# Altium project smu_unit.PrjPcb
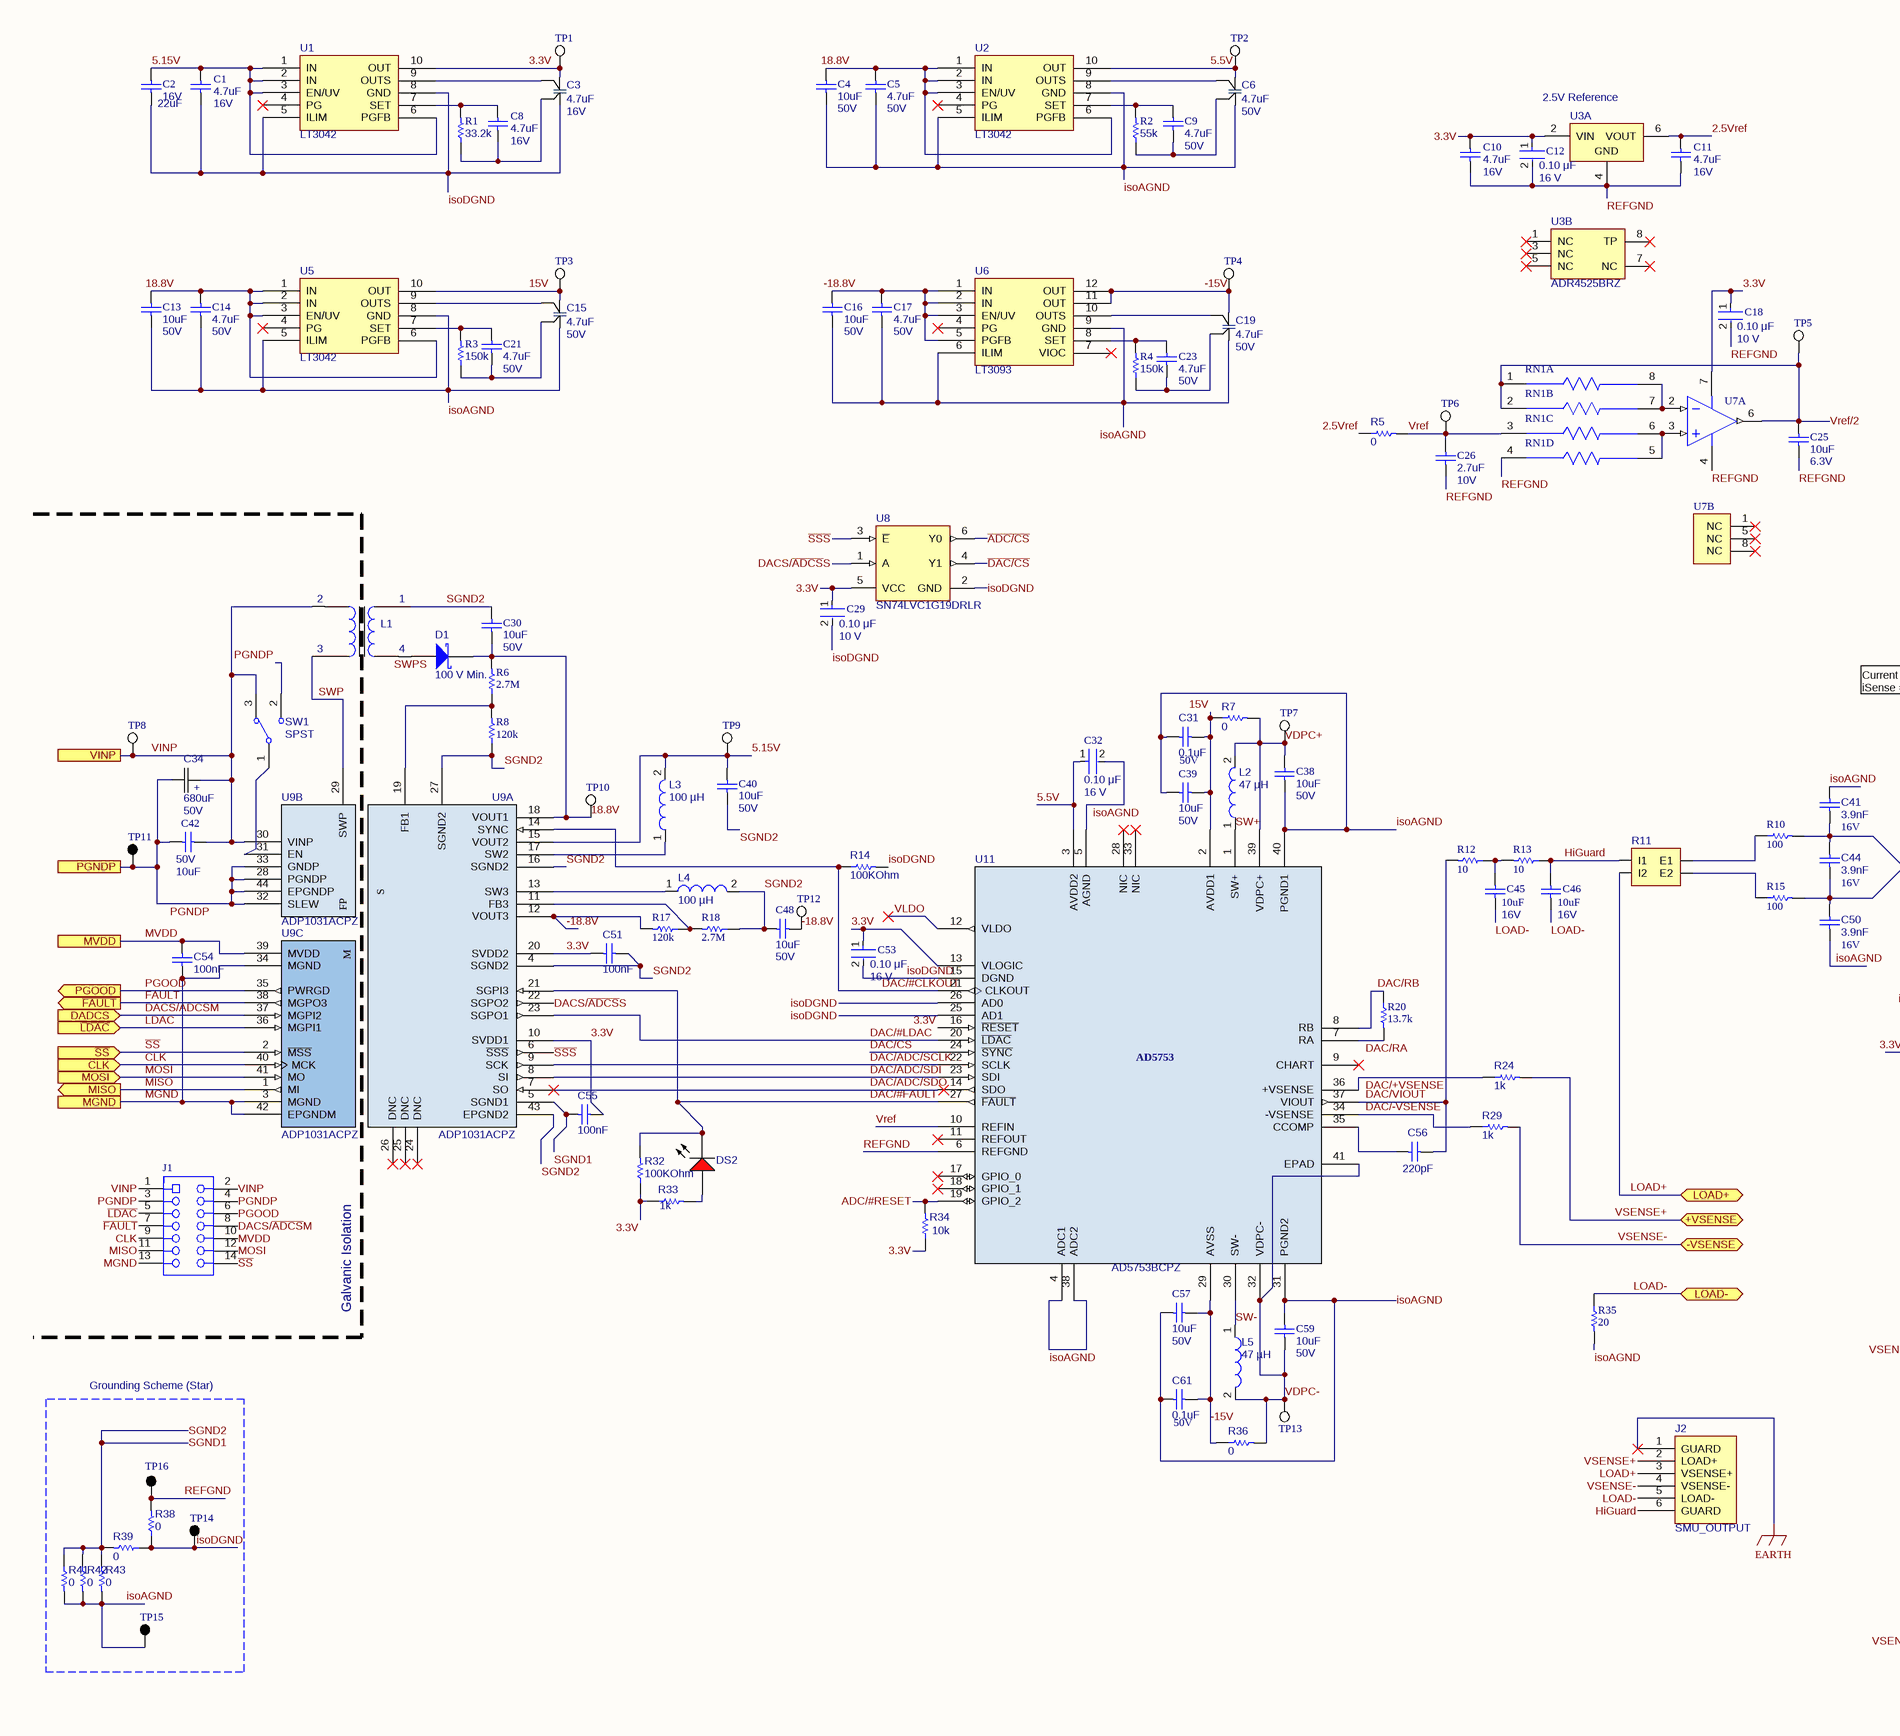
[diagram p0: smu_unit.SchDoc, left]
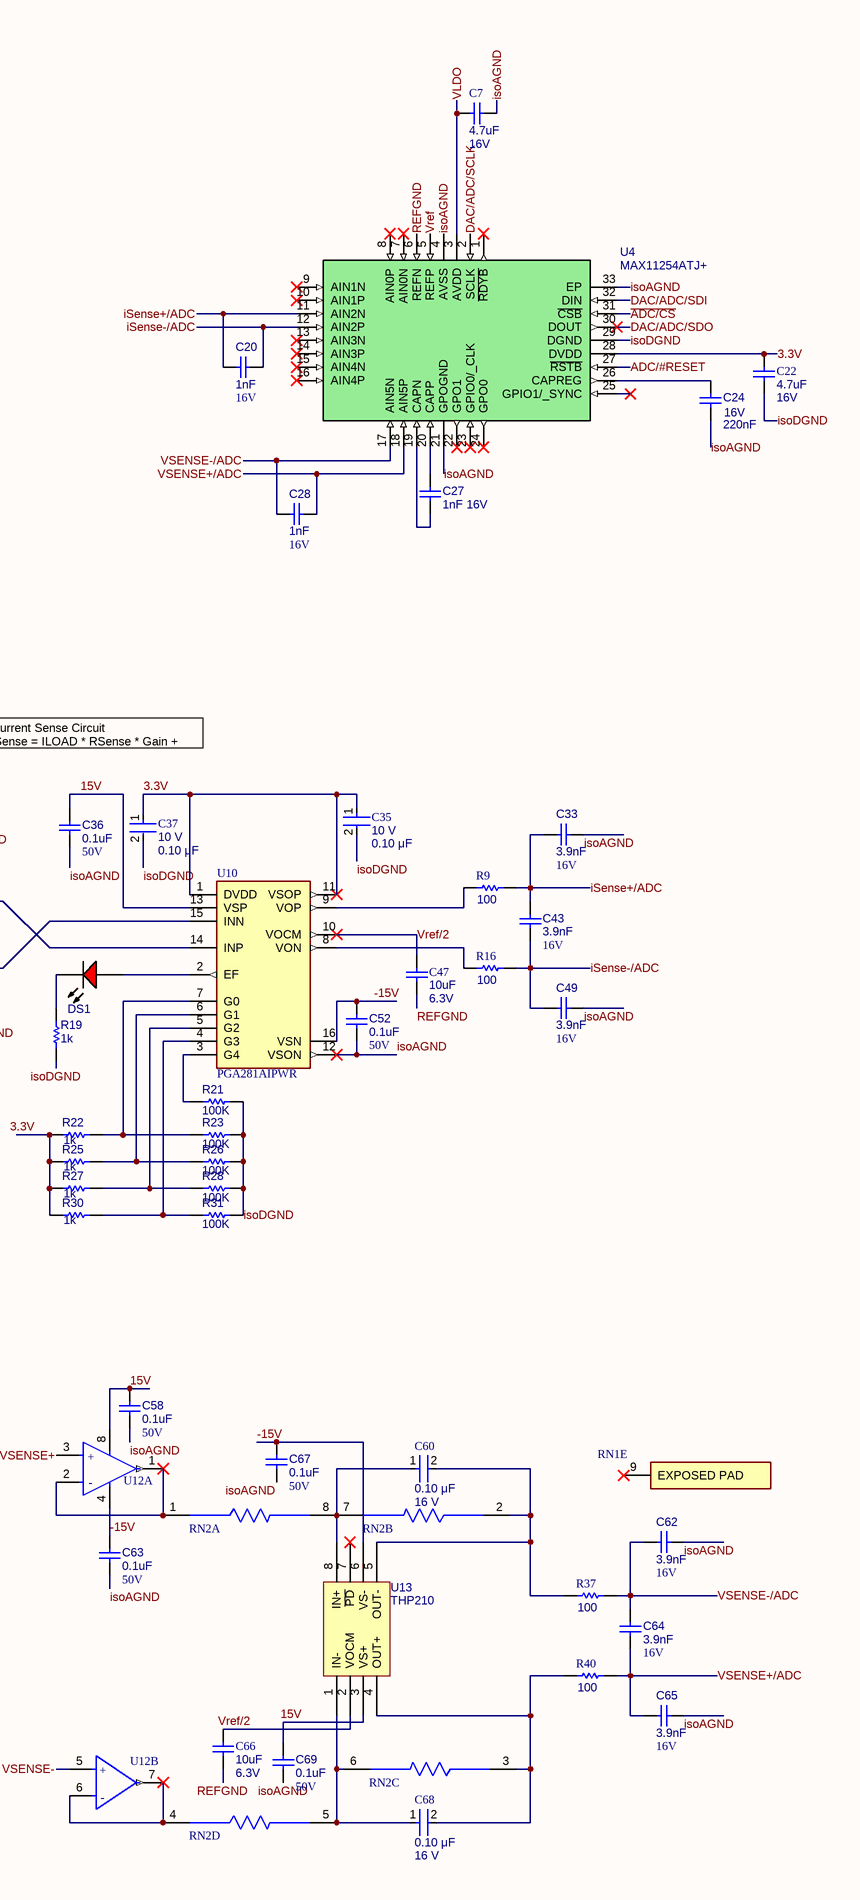
[diagram p1: smu_unit.SchDoc, right]
1 sheet, 154 parts. Net scope: flat (ports and power ports of the same name join across sheets).
Board file: smu_unit.PcbDoc

## Sheet smu_unit.SchDoc: IMEBUILD V3 SMU_UNIT
size A2; Organization: Lightwave Lab; Address1: Princeton University; Address2: Princeton NJ 08544; Address3: United States; DocumentNumber: 1; Revision: C; SheetNumber: 1; SheetTotal: 3

### Parts
C1  value 4.7uF  Rated Voltage: 16V  [CAPC2013X140X50ML20T25]  (hidden comment: C0805C475J4RACAUTO)
C2  Rated Voltage: 16V  Capacitance: 22uF  [CAPC3225X270X30ML30]  (hidden comment: ‎GRM32ER71C226KEA8L‎)
C3  value 4.7uF  Rated Voltage: 16V  [CAP0805_4P]  (hidden comment: CAP08054P)
C4  Capacitance: 10uF  Voltage Rating (DC): 50V  [CAPC3225X280X50ML20T25]  (hidden comment: C1210C106K5RACTU)
C5  Capacitance: 4.7uF  Voltage Rating (DC): 50V  [CAPC3225X280X50ML20T25]  (hidden comment: C1206X475J5RAC7800)
C6  value 4.7uF  Rated Voltage: 50V  [CAP0805_4P]  (hidden comment: CAP08054P)
C7  value 4.7uF  Rated Voltage: 16V  [CAPC2013X140X50ML20T25]  (hidden comment: C0805C475J4RACAUTO)
C8  value 4.7uF  Rated Voltage: 16V  [CAPC2013X140X50ML20T25]  (hidden comment: C0805C475J4RACAUTO)
C9  Capacitance: 4.7uF  Voltage Rating (DC): 50V  [CAPC3225X280X50ML20T25]  (hidden comment: C1206X475J5RAC7800)
C10  value 4.7uF  Rated Voltage: 16V  [CAPC2013X140X50ML20T25]  (hidden comment: C0805C475J4RACAUTO)
C11  value 4.7uF  Rated Voltage: 16V  [CAPC2013X140X50ML20T25]  (hidden comment: C0805C475J4RACAUTO)
C12  Capacitance: 0.10 μF  Voltage Rating: 16 V  [FP-C0805C-DN-IPC_A]  (hidden comment: C0805C104J4RACTU)
C13  Capacitance: 10uF  Voltage Rating (DC): 50V  [CAPC3225X280X50ML20T25]  (hidden comment: C1210C106K5RACTU)
C14  Capacitance: 4.7uF  Voltage Rating (DC): 50V  [CAPC3225X280X50ML20T25]  (hidden comment: C1206X475J5RAC7800)
C15  value 4.7uF  Rated Voltage: 50V  [CAP0805_4P]  (hidden comment: CAP08054P)
C16  Capacitance: 10uF  Voltage Rating (DC): 50V  [CAPC3225X280X50ML20T25]  (hidden comment: C1210C106K5RACTU)
C17  Capacitance: 4.7uF  Voltage Rating (DC): 50V  [CAPC3225X280X50ML20T25]  (hidden comment: C1206X475J5RAC7800)
C18  Voltage Rating: 10 V  Capacitance: 0.10 μF  [FP-C0805C-DN-IPC_A]  (hidden comment: C0805C104J8RACTU)
C19  value 4.7uF  Rated Voltage: 50V  [CAP0805_4P]  (hidden comment: CAP08054P)
C20  Capacitance: 1nF  Voltage Rating: 16V  [CAPC1608X90X20ML10]  (hidden comment: CGA3E2X7R1H104K080AA)
C21  Capacitance: 4.7uF  Voltage Rating (DC): 50V  [CAPC3225X280X50ML20T25]  (hidden comment: C1206X475J5RAC7800)
C22  value 4.7uF  Rated Voltage: 16V  [CAPC2013X140X50ML20T25]  (hidden comment: C0805C475J4RACAUTO)
C23  Capacitance: 4.7uF  Voltage Rating (DC): 50V  [CAPC3225X280X50ML20T25]  (hidden comment: C1206X475J5RAC7800)
C24  Voltage: 16V  Capacitance: 220nF  [CAPC1608X90X40ML10T20]  (hidden comment: CC0603KRX7R7BB224)
C25  value 10uF  Rated Voltage: 6.3V  [CAPC2013X140X50ML20T25]  (hidden comment: C0805X106J9RAC7800)
C26  value 2.7uF  Rated Voltage: 10V  [CAPC2013X145X50ML20T25]  (hidden comment: C0805C275K8PACTU)
C27  1nF 16V  [CAPC1608X87X35ML15T15]
C28  Capacitance: 1nF  Voltage Rating: 16V  [CAPC1608X90X20ML10]  (hidden comment: CGA3E2X7R1H104K080AA)
C29  Voltage Rating: 10 V  Capacitance: 0.10 μF  [FP-C0805C-DN-IPC_A]  (hidden comment: C0805C104J8RACTU)
C30  Capacitance: 10uF  Voltage Rating (DC): 50V  [CAPC3225X280X50ML20T25]  (hidden comment: C1210C106K5RACTU)
C31  Capacitance: 0.1uF  Voltage Rating: 50V  [CAPC1608X90X20ML10]  (hidden comment: CGA3E2X7R1H104K080AA)
C32  Capacitance: 0.10 μF  Voltage Rating: 16 V  [FP-C0805C-DN-IPC_A]  (hidden comment: C0805C104J4RACTU)
C33  Capacitance: 3.9nF  Voltage Rating: 16V  [CAPC1608X90X20ML10]  (hidden comment: CGA3E2X7R1H104K080AA)
C34  value 680uF  Rated Voltage: 50V  [A759PY687M1HAAE026]  (hidden comment: A759PY687M1HAAE026)
C35  Voltage Rating: 10 V  Capacitance: 0.10 μF  [FP-C0805C-DN-IPC_A]  (hidden comment: C0805C104J8RACTU)
C36  Capacitance: 0.1uF  Voltage Rating: 50V  [CAPC1608X90X20ML10]  (hidden comment: CGA3E2X7R1H104K080AA)
C37  Voltage Rating: 10 V  Capacitance: 0.10 μF  [FP-C0805C-DN-IPC_A]  (hidden comment: C0805C104J8RACTU)
C38  Capacitance: 10uF  Voltage Rating (DC): 50V  [CAPC3225X280X50ML20T25]  (hidden comment: C1210C106K5RACTU)
C39  Capacitance: 10uF  Voltage Rating (DC): 50V  [CAPC3225X280X50ML20T25]  (hidden comment: C1210C106K5RACTU)
C40  Capacitance: 10uF  Voltage Rating (DC): 50V  [CAPC3225X280X50ML20T25]  (hidden comment: C1210C106K5RACTU)
C41  Capacitance: 3.9nF  Voltage Rating: 16V  [CAPC1608X90X20ML10]  (hidden comment: CGA3E2X7R1H104K080AA)
C42  Capacitance: 10uF  Voltage Rating (DC): 50V  [CAPC3225X280X50ML20T25]  (hidden comment: C1210C106K5RACTU)
C43  Capacitance: 3.9nF  Voltage Rating: 16V  [CAPC1608X90X20ML10]  (hidden comment: CGA3E2X7R1H104K080AA)
C44  Capacitance: 3.9nF  Voltage Rating: 16V  [CAPC1608X90X20ML10]  (hidden comment: CGA3E2X7R1H104K080AA)
C45  value 10uF  Rated Voltage: 16V  [CAPC3216X16N]  (hidden comment: GCM31CR71C106KA64K)
C46  value 10uF  Rated Voltage: 16V  [CAPC3216X16N]  (hidden comment: GCM31CR71C106KA64K)
C47  value 10uF  Rated Voltage: 6.3V  [CAPC2013X140X50ML20T25]  (hidden comment: C0805X106J9RAC7800)
C48  Capacitance: 10uF  Voltage Rating (DC): 50V  [CAPC3225X280X50ML20T25]  (hidden comment: C1210C106K5RACTU)
C49  Capacitance: 3.9nF  Voltage Rating: 16V  [CAPC1608X90X20ML10]  (hidden comment: CGA3E2X7R1H104K080AA)
C50  Capacitance: 3.9nF  Voltage Rating: 16V  [CAPC1608X90X20ML10]  (hidden comment: CGA3E2X7R1H104K080AA)
C51  Capacitance: 100nF  [CAPC1608X90X20ML10]  (hidden comment: CGA3E2X7R1H104K080AA)
C52  Capacitance: 0.1uF  Voltage Rating: 50V  [CAPC1608X90X20ML10]  (hidden comment: CGA3E2X7R1H104K080AA)
C53  Capacitance: 0.10 μF  Voltage Rating: 16 V  [FP-C0805C-DN-IPC_A]  (hidden comment: C0805C104J4RACTU)
C54  Capacitance: 100nF  [CAPC1608X90X20ML10]  (hidden comment: CGA3E2X7R1H104K080AA)
C55  Capacitance: 100nF  [CAPC1608X90X20ML10]  (hidden comment: CGA3E2X7R1H104K080AA)
C56  value 220pF  [CAPC1005X55X25ML05T10]  (hidden comment: GCM155R71H221KA37D)
C57  Capacitance: 10uF  Voltage Rating (DC): 50V  [CAPC3225X280X50ML20T25]  (hidden comment: C1210C106K5RACTU)
C58  Capacitance: 0.1uF  Voltage Rating: 50V  [CAPC1608X90X20ML10]  (hidden comment: CGA3E2X7R1H104K080AA)
C59  Capacitance: 10uF  Voltage Rating (DC): 50V  [CAPC3225X280X50ML20T25]  (hidden comment: C1210C106K5RACTU)
C60  Capacitance: 0.10 μF  Voltage Rating: 16 V  [FP-C0805C-DN-IPC_A]  (hidden comment: C0805C104J4RACTU)
C61  Capacitance: 0.1uF  Voltage Rating: 50V  [CAPC1608X90X20ML10]  (hidden comment: CGA3E2X7R1H104K080AA)
C62  Capacitance: 3.9nF  Voltage Rating: 16V  [CAPC1608X90X20ML10]  (hidden comment: CGA3E2X7R1H104K080AA)
C63  Capacitance: 0.1uF  Voltage Rating: 50V  [CAPC1608X90X20ML10]  (hidden comment: CGA3E2X7R1H104K080AA)
C64  Capacitance: 3.9nF  Voltage Rating: 16V  [CAPC1608X90X20ML10]  (hidden comment: CGA3E2X7R1H104K080AA)
C65  Capacitance: 3.9nF  Voltage Rating: 16V  [CAPC1608X90X20ML10]  (hidden comment: CGA3E2X7R1H104K080AA)
C66  value 10uF  Rated Voltage: 6.3V  [CAPC2013X140X50ML20T25]  (hidden comment: C0805X106J9RAC7800)
C67  Capacitance: 0.1uF  Voltage Rating: 50V  [CAPC1608X90X20ML10]  (hidden comment: CGA3E2X7R1H104K080AA)
C68  Capacitance: 0.10 μF  Voltage Rating: 16 V  [FP-C0805C-DN-IPC_A]  (hidden comment: C0805C104J4RACTU)
C69  Capacitance: 0.1uF  Voltage Rating: 50V  [CAPC1608X90X20ML10]  (hidden comment: CGA3E2X7R1H104K080AA)
D1  V(BR)R: 100 V Min.  [DIOD-SOD-123-2_V]  (hidden comment: BAT46W-7-F)
DS1  TLMS1000-GS08  [VISH-TLMS1000_V]  (value not drawn)
DS2  TLMS1000-GS08  [VISH-TLMS1000_V]  (value not drawn)
J1  61031421821  [61031421821]  (value not drawn)
J2  SMU_OUTPUT  [HEADER 6 SMD]
L1  750316743  [750316743]  (value not drawn)
L2  Inductance: 47 µH  [WE-TPC-5818-L]  (hidden comment: 744052470)
L3  Inductance: 100 µH  [WE-TPC-4828-MH]  (hidden comment: 744043101)
L4  Inductance: 100 µH  [WE-TPC-4828-MH]  (hidden comment: 744043101)
L5  Inductance: 47 µH  [WE-TPC-5818-L]  (hidden comment: 744052470)
R1  value 33.2k  [RESC2013X55X40ML15T20]  (hidden comment: TNPW080533K2BEEN)
R2  value 55k  [RESC2013X55X40ML15T20]  (hidden comment: TNPW0805150KBEEN)
R3  value 150k  [RESC2013X55X40ML15T20]  (hidden comment: TNPW080560K4BEEN)
R4  value 150k  [RESC2013X55X40ML15T20]  (hidden comment: TNPW0805150KBEEN)
R5  0  [RESC3216X105X45ML10T20]
R6  value 2.7M  [RESC3216X04N]  (hidden comment: ‎RG3216P-2704-B-T1‎)
R7  0  [RESC3216X105X45ML10T20]
R8  value 120k  [RESC3216X04N]  (hidden comment: TNPW1206120KBEEA)
R9  value 100  [RESC2013X55X40ML15T20]  (hidden comment: TNPW0805100KBEEA)
R10  value 100  [RESC3216X04N]  (hidden comment: TNPW1206100RBYEN)
R11  Y160610R0000D9W  [RShunt]  (value not drawn)
R12  value 10  [RESC3216X04N]  (hidden comment: ‎TNPW120610R0BEEA‎)
R13  value 10  [RESC3216X04N]  (hidden comment: ‎TNPW120610R0BEEA‎)
R14  Resistance: 100KOhm  [RESC1608X55X25ML10T15]  (hidden comment: RC0603FR-07100KL)
R15  value 100  [RESC3216X04N]  (hidden comment: TNPW1206100RBYEN)
R16  value 100  [RESC2013X55X40ML15T20]  (hidden comment: TNPW0805100KBEEA)
R17  value 120k  [RESC3216X04N]  (hidden comment: TNPW1206120KBEEA)
R18  value 2.7M  [RESC3216X04N]  (hidden comment: ‎RG3216P-2704-B-T1‎)
R19  value 1k  [RESC1608X55X30ML15T15]  (hidden comment: ERJ-3EKF1001V)
R20  value 13.7k  [RESC2012X04N]  (hidden comment: TNPW080513K7BEEN)
R21  Resistance: 100K  [RESC1608X55X25ML10T15]  (hidden comment: RC0603FR-07100KL)
R22  value 1k  [RESC1608X55X30ML15T15]  (hidden comment: ERJ-3EKF1001V)
R23  Resistance: 100K  [RESC1608X55X25ML10T15]  (hidden comment: RC0603FR-07100KL)
R24  1k  [RESC2013X50X30ML20T20]
R25  value 1k  [RESC1608X55X30ML15T15]  (hidden comment: ERJ-3EKF1001V)
R26  Resistance: 100K  [RESC1608X55X25ML10T15]  (hidden comment: RC0603FR-07100KL)
R27  value 1k  [RESC1608X55X30ML15T15]  (hidden comment: ERJ-3EKF1001V)
R28  Resistance: 100K  [RESC1608X55X25ML10T15]  (hidden comment: RC0603FR-07100KL)
R29  1k  [RESC2013X50X30ML20T20]
R30  value 1k  [RESC1608X55X30ML15T15]  (hidden comment: ERJ-3EKF1001V)
R31  Resistance: 100K  [RESC1608X55X25ML10T15]  (hidden comment: RC0603FR-07100KL)
R32  Resistance: 100KOhm  [RESC1608X55X25ML10T15]  (hidden comment: RC0603FR-07100KL)
R33  value 1k  [RESC1608X55X30ML15T15]  (hidden comment: ERJ-3EKF1001V)
R34  value 10k  [RESC1608X55X25ML10T15]  (hidden comment: RT0603BRE0710KL)
R35  value 20  [RESC3216X04N]  (hidden comment: TNPW120620R0BEEN)
R36  0  [RESC3216X105X45ML10T20]
R37  value 100  [RESC2013X55X40ML15T20]  (hidden comment: TNPW0805100KBEEA)
R38  0  [RESC3216X105X45ML10T20]
R39  0  [RESC3216X105X45ML10T20]
R40  value 100  [RESC2013X55X40ML15T20]  (hidden comment: TNPW0805100KBEEA)
R41  0  [RESC3216X105X45ML10T20]
R42  0  [RESC3216X105X45ML10T20]
R43  0  [RESC3216X105X45ML10T20]
RN1  LT5400AHMS8E-4#PBF  [FP-MS8E-8-05-08-1662-MFG]  (value not drawn)  (parts A,B,C,D,E of 5)
RN2  LT5400AHMS8E-4#PBF  [FP-MS8E-8-05-08-1662-MFG]  (value not drawn)  (parts A,B,C,D of 5)
SW1  Contact Configuration: SPST  [EOZ-09.03201.02-3]  (hidden comment: 09.03201.02)
TP1  5002  [KSTN-5002]  (value not drawn)
TP2  5002  [KSTN-5002]  (value not drawn)
TP3  5002  [KSTN-5002]  (value not drawn)
TP4  5002  [KSTN-5002]  (value not drawn)
TP5  5002  [KSTN-5002]  (value not drawn)
TP6  5002  [KSTN-5002]  (value not drawn)
TP7  5002  [KSTN-5002]  (value not drawn)
TP8  5002  [KSTN-5002]  (value not drawn)
TP9  5002  [KSTN-5002]  (value not drawn)
TP10  5002  [KSTN-5002]  (value not drawn)
TP11  5001  [KSTN-5001]  (value not drawn)
TP12  5002  [KSTN-5002]  (value not drawn)
TP13  5002  [KSTN-5002]  (value not drawn)
TP14  5001  [KSTN-5001]  (value not drawn)
TP15  5001  [KSTN-5001]  (value not drawn)
TP16  5001  [KSTN-5001]  (value not drawn)
U1  LT3042  [TSSOP50P490X110-10N]
U2  LT3042  [TSSOP50P490X110-10N]
U3  Vout: 2.5V Reference  [ADI-R-8_M]  (hidden comment: ADR4525BRZ)  (parts A,B of 2)
U4  MAX11254ATJ+  [QFN50P500X500X80-33N]
U5  LT3042  [TSSOP50P490X110-10N]
U6  LT3093  [TSOP65P510X110_HS-13N]
U7  ADA4528-1ARMZ  [ADI-RM-8_M]  (value not drawn)  (parts A,B of 2)
U8  SN74LVC1G19DRLR  [DRL0006A_M]
U9  ADP1031ACPZ  [CP_41_1]  (parts A,B,C of 3)
U10  PGA281AIPWR  [FP-PW0016A-IPC_A]
U11  AD5753BCPZ  [cp_40_15-M]
U12  ADA4522-2ARMZ  [FP-RM-8-IPC_C]  (value not drawn)  (parts A,B of 2)
U13  THP210  [TSOP65P490X110-8N]

### Blocks framed on the sheet
Grounding Scheme (Star): R38 R39 R41-R43 TP14-TP16

### Ports
+VSENSE (bidir), -VSENSE (bidir), CLK (in), DADCS (in), LOAD+ (bidir), LOAD- (bidir), MGND, MISO (out), MOSI (in), MVDD, PGNDP, PGOOD (out), VINP, ~{FAULT} (out), ~{LDAC} (in), ~{SS} (in)

### Nets
EARTH: J2.1(GUARD)
2.5Vref: C11.1 R5.1 U3.6(VOUT)
3.3V: C3.1 C10.1 C12.1 C18.1 C22.2 C29.1 C35.1 C37.1 C51.2 C53.1 C55.1 R22.1 R25.1 R27.1 R30.1 R32.1 R33.1 R34.1 TP1.1 U1.10(OUT) U3.2(VIN) U4.28(DVDD) U7.7(+V) U8.5(VCC) U9.10(SVDD1) U9.20(SVDD2) U10.1(DVDD) U10.11(VSOP) U11.13(VLOGIC) U11.16(~{RESET})
5.5V: C6.1 C32.1 TP2.1 U2.10(OUT) U11.3(AVDD2)
5.15V: C1.1 C2.2 C40.2 L3.2 TP9.1 U1.1(IN) U1.2(IN) U1.3(EN/UV) U1.6(PGFB) U9.15(VOUT2)
15V: C15.1 C31.1 C36.1 C39.2 C58.1 C69.1 R7.1 TP3.1 U5.10(OUT) U10.13(VSP) U11.2(AVDD1) U12.8(V+) U13.3(VS+)
18.8V: C4.2 C5.2 C13.2 C14.2 C30.1 D1.2(K) R6.2 TP10.1 U2.1(IN) U2.2(IN) U2.3(EN/UV) U2.6(PGFB) U5.1(IN) U5.2(IN) U5.3(EN/UV) U5.6(PGFB) U9.18(VOUT1)
-15V: C19.1 C52.1 C57.1 C61.1 C63.1 C67.1 R36.1 TP4.1 U6.11(OUT) U6.12(OUT) U10.16(VSN) U11.29(AVSS) U12.4(V-) U13.6(VS-)
-18.8V: C16.2 C17.2 C48.1 R17.2 TP12.1 U6.1(IN) U6.2(IN) U6.3(EN/UV) U6.5(PGFB) U9.12(VOUT3)
~{ADC/CS}: U4.31(~{CSB}) U8.6(Y0)
~{DAC/CS}: U8.4(Y1) U11.24(~{SYNC})
~{FAULT}: J1.7 U9.38(MGPO3) ; port ~{FAULT}
~{LDAC}: J1.5 U9.36(MGPI1) ; port ~{LDAC}
~{SS}: J1.14 U9.2(~{MSS}) ; port ~{SS}
~{SSS}: U8.3(~{E}) U9.6(~{SSS})
ADC/#RESET: R34.2 U4.27(~{RSTB}) U11.19(GPIO_2)
CLK: J1.9 U9.40(MCK) ; port CLK
DAC/#CLKOUT: R14.1 U9.14(SYNC) U11.21(CLKOUT)
DAC/#FAULT: DS2.2(K) R32.2 U9.21(SGPI3) U11.27(~{FAULT})
DAC/#LDAC: U9.23(SGPO1) U11.20(~{LDAC})
DAC/+VSENSE: R24.1 U11.36(+VSENSE)
DAC/-VSENSE: R29.1 U11.34(-VSENSE)
DAC/ADC/SCLK: U4.2(SCLK) U9.9(SCK) U11.22(SCLK)
DAC/ADC/SDI: U4.32(DIN) U9.8(SI) U11.23(SDI)
DAC/ADC/SDO: U4.30(DOUT) U9.7(SO) U11.14(SDO)
DAC/RA: R20.2 U11.7(RA)
DAC/RB: R20.1 U11.8(RB)
DAC/VIOUT: C56.2 R12.2 U11.37(VIOUT)
DACS/~{ADCS}M: J1.8 U9.37(MGPI2) ; port DADCS
DACS/~{ADCS}S: U8.1(A) U9.22(SGPO2)
HiGuard: C46.2 J2.6(GUARD) R11.1(I1) R13.1
iSense+/ADC: C20.1 C33.1 C43.2 R9.2 U4.11(AIN2N)
iSense-/ADC: C20.2 C43.1 C49.2 R16.2 U4.12(AIN2P)
isoAGND: C4.1 C5.1 C6.3 C7.2 C13.1 C14.1 C15.3 C16.1 C17.1 C19.3 C24.2 C31.2 C32.2 C33.2 C36.2 C38.2 C39.1 C41.1 C49.1 C50.2 C52.2 C57.2 C58.2 C59.1 C61.2 C62.1 C63.2 C65.2 C67.2 C69.2 R35.2 R41.2 R42.2 R43.2 TP15.1 U2.5(ILIM) U2.8(GND) U4.4(AVSS) U4.21(GPOGND) U4.33(EP) U5.5(ILIM) U5.8(GND) U6.6(ILIM) U6.9(GND) U10.12(VSON) U11.4(ADC1) U11.5(AGND) U11.31(PGND2) U11.38(ADC2) U11.40(PGND1)
isoDGND: C1.2 C2.1 C3.3 C22.1 C29.2 C35.2 C37.2 C53.2 R14.2 R19.1 R21.1 R23.1 R26.1 R28.1 R31.1 R38.1 R39.1 TP14.1 U1.5(ILIM) U1.8(GND) U4.29(DGND) U8.2(GND) U11.15(DGND) U11.25(AD1) U11.26(AD0)
LOAD+: J2.3(VSENSE+) R11.2(I2) ; port LOAD+
LOAD-: C45.1 C46.1 J2.5(LOAD-) R35.1 ; port LOAD-
MGND: C54.1 J1.13 U9.3(MGND) U9.34(MGND) U9.42(EPGNDM) ; port MGND
MISO: J1.11 U9.1(MI) ; port MISO
MOSI: J1.12 U9.41(MO) ; port MOSI
MVDD: C54.2 J1.10 U9.39(MVDD) ; port MVDD
PGNDP: C34.2 C42.1 J1.3 J1.4 SW1.2 TP11.1 U9.28(PGNDP) U9.32(SLEW) U9.33(GNDP) U9.44(EPGNDP) ; port PGNDP
PGOOD: J1.6 U9.35(PWRGD) ; port PGOOD
REFGND: C10.2 C11.2 C12.2 C18.2 C25.1 C26.1 C47.1 C66.1 R38.2 RN1.4(1_R4) TP16.1 U3.4(GND) U4.6(REFN) U7.4(-V) U11.6(REFGND)
SGND1: C30.2 C40.1 C48.2 C51.1 C55.2 L1.1 L4.2 R8.1 R18.1 R39.2 R41.1 R42.1 R43.1 U9.4(SGND2) U9.5(SGND1) U9.16(SGND2) U9.27(SGND2) U9.43(EPGND2)  [also labelled SGND2]
SW+: L2.1 U11.1(SW+)
SW-: L5.1 U11.30(SW-)
SWP: L1.3 U9.29(SWP)
SWPS: D1.1(A) L1.4
VDPC+: C38.1 L2.2 R7.2 TP7.1 U11.39(VDPC+)
VDPC-: C59.2 L5.2 R36.2 TP13.1 U11.32(VDPC-) U11.41(EPAD)
VINP: C34.1 C42.2 J1.1 J1.2 L1.2 SW1.3 TP8.1 U9.30(VINP) ; port VINP
VLDO: C7.1 U4.3(AVDD) U11.12(VLDO)
Vref: C26.2 R5.2 RN1.3(1_R3) TP6.1 U4.5(REFP) U11.10(REFIN)
Vref/2: C25.2 C47.2 C66.2 RN1.1(1_R1) RN1.2(1_R2) TP5.1 U7.6(OUT) U10.10(VOCM) U13.2(VOCM)
VSENSE+: J2.2(LOAD+) R24.2 U12.3(+IN_A) ; port +VSENSE
VSENSE+/ADC: C28.2 C64.2 C65.1 R40.2 U4.18(AIN5P)
VSENSE-: J2.4(VSENSE-) R29.2 U12.5(+IN_B) ; port -VSENSE
VSENSE-/ADC: C28.1 C62.2 C64.1 R37.2 U4.17(AIN5N)
NetC3_2: C3.2 U1.9(OUTS)
NetC3_4: C3.4 C8.2 R1.1
NetC6_2: C6.2 U2.9(OUTS)
NetC6_4: C6.4 C9.1 R2.1
NetC8_1: C8.1 R1.2 U1.7(SET)
NetC9_2: C9.2 R2.2 U2.7(SET)
NetC15_2: C15.2 U5.9(OUTS)
NetC15_4: C15.4 C21.1 R3.1
NetC19_2: C19.2 U6.10(OUTS)
NetC19_4: C19.4 C23.1 R4.1
NetC21_2: C21.2 R3.2 U5.7(SET)
NetC23_2: C23.2 R4.2 U6.8(SET)
NetC24_1: C24.1 U4.26(CAPREG)
NetC27_1: C27.1 U4.19(CAPN)
NetC27_2: C27.2 U4.20(CAPP)
NetC41_2: C41.2 C44.1 R10.2 U10.14(INP)
NetC44_2: C44.2 C50.1 R15.2 U10.15(INN)
NetC45_2: C45.2 R12.1 R13.2
NetC56_1: C56.1 U11.35(CCOMP)
NetC60_1: C60.1 RN2.7(2_R2) RN2.8(2_R1) U13.8(IN+)
NetC60_2: C60.2 R37.1 RN2.2(1_R2) U13.5(OUT-)
NetC68_1: C68.1 RN2.5(2_R4) RN2.6(2_R3) U13.1(IN-)
NetC68_2: C68.2 R40.1 RN2.3(1_R3) U13.4(OUT+)
NetDS1_1: DS1.1(A) U10.2(EF)
NetDS1_2: DS1.2(K) R19.2
NetDS2_1: DS2.1(A) R33.2
NetL3_1: L3.1 U9.17(SW2)
NetL4_1: L4.1 U9.13(SW3)
NetR6_1: R6.1 R8.2 U9.19(FB1)
NetR9_1: R9.1 U10.9(VOP)
NetR10_1: R10.1 R11.3(E1)
NetR11_4: R11.4(E2) R15.1
NetR16_1: R16.1 U10.8(VON)
NetR17_1: R17.1 R18.2 U9.11(FB3)
NetR21_2: R21.2 U10.3(G4)
NetR22_2: R22.2 R23.2 U10.7(G0)
NetR25_2: R25.2 R26.2 U10.6(G1)
NetR27_2: R27.2 R28.2 U10.5(G2)
NetR30_2: R30.2 R31.2 U10.4(G3)
NetRN1_5: RN1.5(2_R4) RN1.6(2_R3) U7.3(+IN)
NetRN1_7: RN1.7(2_R2) RN1.8(2_R1) U7.2(-IN)
NetRN2_1: RN2.1(1_R1) U12.1(OUT_A) U12.2(-IN_A)
NetRN2_4: RN2.4(1_R4) U12.6(-IN_B) U12.7(OUT_B)
NetSW1_1: SW1.1 U9.31(EN)

Not connected (* = marked no-connect by the designer): RN1 9(EXPOSED_PAD)*; U1 4(PG)*; U2 4(PG)*; U3 1(NC)* 3(NC)* 5(NC)* 7(NC)* 8(TP)*; U4 1(~{RDYB})* 7(AIN0N)* 8(AIN0P)* 9(AIN1N)* 10(AIN1P)* 13(AIN3N)* 14(AIN3P)* 15(AIN4N)* 16(AIN4P)* 22(GPO1)* 23(GPIO0/_CLK)* 24(GPO0)* 25(GPIO1/_SYNC)*; U5 4(PG)*; U6 4(PG)* 7(VIOC)*; U7 1(NC)* 5(NC)* 8(NC)*; U9 24(DNC)* 25(DNC)* 26(DNC)*; U11 9(CHART)* 11(REFOUT)* 17(GPIO_0)* 18(GPIO_1)* 28(NIC)* 33(NIC)*; U13 7(~{PD})*

### Notes on the sheet
- Current Sense Circuit
  iSense = ILOAD * RSense * Gain + 1.25V
- Galvanic Isolation
- Title
- Date:
- File:
- Size:
- A2
- Revision:
- Sheet
- /
- (in symbol A759PY687M1HAAE026) +
- (in symbol AD5753BCPZ) AD5753
- (in symbol ADP1031ACPZ, part A) S
- (in symbol ADP1031ACPZ, part B) FP
- (in symbol ADP1031ACPZ, part C) M
- (in symbol CMP-09116-000003-2, part A) +; -
- (in symbol CMP-09116-000003-2, part B) +; -

### Library data of the parts
C1 C7 C8 C10 C11 C22 = CMP-2007-03297-1: Part Number: C0805C475K4PACTU; Manufacturer: Kemet
C2 = CMP-2000-06364-1: Chip Capacitor, 22 uF, +/- 10%, 16 V, -55 to 125 degC, 1210 (3225 Metric), RoHS, Tape and Reel; Manufacturer: Murata; Dielectric: X7R; Case Size/Dimension: 1210; Datasheet Version: 11/2010; Mounting Technology: SurfaceMount; Package Description: 2-Pin Surface Mount Device, Body 3.2 x 2.5 mm; Manufacturer URL: http://www.murata.com/; Datasheet URL: http://media.digikey.com/pdf/Data%20Sheets/Murata%20PDFs/grm32er71c226ke18.pdf; Package Reference: 1210; Tolerance (%): ±10%
C3 C6 C15 C19 = CAP0805_4P
C4 C5 C9 C13 C14 C16 C17 C21 C23 C30 C38-C40 C42 C48 C57 C59 = CMP-2000-07565-1: Chip Capacitor, 10 uF, +/- 10%, 50 V, -55 to 125 degC, 1210 (3225 Metric), RoHS, Tape and Reel; Manufacturer: Kemet; Dielectric: X7R; Dielectric Material: Ceramic; Case\/Package: 1210; Mount: SurfaceMount; Package Description: 2-Pin Surface Mount Device, Body 3.2 x 2.5 mm; Case Code (Metric): 3225; Weight: 0.000564oz; Datasheet Version: 06/2017; RoHSCompliant: True; Termination: SMD/SMT; Package Quantity: 1000; Height: 2.5mm; Min Operating Temperature: -55degC; Length: 3.2mm; Voltage Rating: 50V; Packaging: TapeandReel; Thickness: 0.11inch; Tolerance: 10%; Width: 2.5mm; Case Code (Imperial): 1210; Mounting Technology: SurfaceMount; Package Reference: 1210; Datasheet URL: http://www.kemet.com/Lists/ProductCatalog/Attachments/53/KEM_C1002_X7R_SMD.pdf; Voltage: 50V; Max Operating Temperature: 125degC; REACH SVHC: NoSVHC; Depth: 2.5mm; Manufacturer URL: http://www.kemet.com/; Parameter 1: *
C12 C32 C53 C60 C68 = CMP-03020-007116-1: CAP CER 0.1UF 16V X7R 0805; Manufacturer: KEMET; Value: 0.10 μF; Material: Ceramic; Temperature Coefficient: 30ppm/°C; Tolerance: 0.05; Mouser Description: Multilayer Ceramic Capacitors MLCC - SMD/SMT 16volts 0.1uF X7R 5%; Device Class L2: Capacitors; Temperature: -55°C to +125°C; RoHS: TRUE; Category: Cap; Octopart: https://octopart.com/c0805c104j4ractu-kemet-12563748; Temperature Range Low: -55°C; ComponentLink2URL: https://content.kemet.com/datasheets/KEM_C1003_C0G_SMD.pdf; Manufacturer Part Number: C0805C104J4RACTU; Ipc Land Pattern Name: CAPC200125X78; Device Class L3: Ceramic Capacitors; Device Class L1: Passive Components; Digikey Description: CAP CER 0.1UF 16V X7R 0805; Temperature Characteristic: X7R; Temperature Range High: +125°C; Package: C0805C-DN; ComponentLink2Description: Datasheet; Height: 0.88mm; Lead Free: Yes; Automotive: No
C18 C29 C35 C37 = CMP-03020-032188-1: CAP CER 0.1UF 10V 5% X7R 0805; Manufacturer: KEMET; Material: Ceramic; Tolerance: 0.05; Temperature Coefficient: 30ppm/°C; Value: 0.10 μF; Package: C0805C-DN; Device Class L1: Passive Components; Temperature: -55°C to +125°C; Category: Cap; RoHS: TRUE; Mouser Description: Multilayer Ceramic Capacitors MLCC - SMD/SMT 10volts 0.1uF X7R 5%; Lead Free: Yes; Temperature Range Low: -55°C; Temperature Range High: +125°C; Device Class L2: Capacitors; Temperature Characteristic: X7R; Device Class L3: Ceramic Capacitors; ComponentLink2Description: Datasheet; Automotive: No; Ipc Land Pattern Name: CAPC200125X78; Manufacturer Part Number: C0805C104J8RACTU; Height: 0.88mm; Digikey Description: CAP CER 0.1UF 10V 5% X7R 0805; Octopart: https://octopart.com/c0805c104j8ractu-kemet-11807087; ComponentLink2URL: https://content.kemet.com/datasheets/KEM_C1003_C0G_SMD.pdf
C20 C28 C33 C41 C43 C44 C49-C51 C55 C62 C64 C65 = CMP-2000-07546-1: Chip Capacitor, 0.1 uF, +/- 10%, 50 V, -55 to 125 degC, 0603 (1608 Metric), RoHS, Tape and Reel; Manufacturer: TDK; Voltage: 50V; Dielectric: X7R; Package Reference: 603; Radiation Hardening: No; Composition: Ceramic; Datasheet URL: https://product.tdk.com/info/en/catalog/datasheets/mlcc_automotive_general_en.pdf; Mounting Technology: SurfaceMount; Datasheet Version: 12/2014; Width: 0.8mm; Length: 1.6mm; Tolerance: 10%; Case Code (Imperial): 0603; RoHSCompliant: True; Min Operating Temperature: -55degC; Package Description: 2-Pin Surface Mount Device, Body 1.6 x 0.8 mm; Packaging: TapeandReel; Package Quantity: 1; Mount: SurfaceMount; Lead Free: LeadFree; Depth: 0.8mm; Termination: SMD/SMT; Case Code (Metric): 1608; Thickness: 0.035inch; Height: 0.8mm; Weight: 7.1E-05oz; Voltage Rating (DC): 50V; REACH SVHC: NoSVHC; Manufacturer URL: http://www.tdk.com/; Case/Package: 0603; Max Operating Temperature: 125degC
  C51 C55: Voltage Rating: 50V
C24 = CMP-2100-03597-1: Chip Capacitor, 220 nF, +/- 10%, 16 V, -55 to 125 degC, 0603 (1608 Metric), RoHS, Tape and Reel; Manufacturer: Yageo; Dielectric: X7R; Depth: 0.8mm; REACH SVHC: NoSVHC; Mount: SurfaceMount; Tolerance: 10%; Packaging: TapeandReel; Case Code (Metric): 1608; Package Quantity: 1; Length: 1.6mm; Case Code (Imperial): 0603; Package Description: 2-Pin Surface Mount Device, Body 1.6 x 0.8 mm; Voltage Rating (DC): 16V; Radiation Hardening: No; Max Operating Temperature: 125degC; Manufacturer URL: http://www.yageo.com/; Case/Package: 0603; Min Operating Temperature: -55degC; Thickness: 0.035inch; Package Reference: 0603; Height: 0.8mm; Datasheet Version: Rev. 15, 10/2016; RoHSCompliant: True; Datasheet URL: http://www.yageo.com/documents/recent/UPY-GPHC_X7R_6.3V-to-50V_15.pdf; Width: 0.031inch; Voltage Rating: 16V; Lead Free: LeadFree
C25 C47 C66 = CMP-2007-03243-1: Part Number: C0805C106K8PACTU; Manufacturer: Kemet
C26 = CMP-2007-01029-1: Manufacturer: Kemet; Part Number: C0805C275K8PACTU
C27 = CMP-2006-03010-1: C0603C102J3GACTU; Manufacturer: Kemet; Part Number: C0603C102J3GACTU
C31 C36 C52 C58 C61 C63 C67 C69 = CMP-2000-07546-1: Chip Capacitor, 0.1 uF, +/- 10%, 50 V, -55 to 125 degC, 0603 (1608 Metric), RoHS, Tape and Reel; Manufacturer: TDK; Dielectric: X7R; Package Reference: 603; Radiation Hardening: No; Composition: Ceramic; Datasheet URL: https://product.tdk.com/info/en/catalog/datasheets/mlcc_automotive_general_en.pdf; Mounting Technology: SurfaceMount; Datasheet Version: 12/2014; Width: 0.8mm; Length: 1.6mm; Voltage: 50V; Tolerance: 10%; Case Code (Imperial): 0603; RoHSCompliant: True; Min Operating Temperature: -55degC; Package Description: 2-Pin Surface Mount Device, Body 1.6 x 0.8 mm; Packaging: TapeandReel; Package Quantity: 1; Mount: SurfaceMount; Lead Free: LeadFree; Depth: 0.8mm; Termination: SMD/SMT; Case Code (Metric): 1608; Thickness: 0.035inch; Height: 0.8mm; Weight: 7.1E-05oz; Voltage Rating (DC): 50V; REACH SVHC: NoSVHC; Manufacturer URL: http://www.tdk.com/; Case/Package: 0603; Max Operating Temperature: 125degC
C45 C46 = Cap Semi: Capacitor (Semiconductor SIM Model); Published: 8-Jun-2000; LatestRevisionDate: 29-May-2009; LatestRevisionNote: IPC-7351 Footprint Added.; PackageReference: C1206; Publisher: Altium Limited; PackageDescription: Chip Capacitor
C54 = CMP-2000-07546-1: Chip Capacitor, 0.1 uF, +/- 10%, 16 V, -55 to 125 degC, 0603 (1608 Metric), RoHS, Tape and Reel; Manufacturer: TDK; Voltage: 50V; Dielectric: X7R; Package Reference: 603; Radiation Hardening: No; Composition: Ceramic; Datasheet URL: https://product.tdk.com/info/en/catalog/datasheets/mlcc_automotive_general_en.pdf; Mounting Technology: SurfaceMount; Datasheet Version: 12/2014; Width: 0.8mm; Length: 1.6mm; Tolerance: 10%; Case Code (Imperial): 0603; RoHSCompliant: True; Min Operating Temperature: -55degC; Package Description: 2-Pin Surface Mount Device, Body 1.6 x 0.8 mm; Packaging: TapeandReel; Package Quantity: 1; Voltage Rating: 50V; Mount: SurfaceMount; Lead Free: LeadFree; Depth: 0.8mm; Termination: SMD/SMT; Case Code (Metric): 1608; Thickness: 0.035inch; Height: 0.8mm; Weight: 7.1E-05oz; Voltage Rating (DC): 50V; REACH SVHC: NoSVHC; Manufacturer URL: http://www.tdk.com/; Case/Package: 0603; Max Operating Temperature: 125degC
C56 = CMP-2008-03726-1: Manufacturer: Murata; Part Number: GCM155R71H221KA37D
D1 = CMP-0303-00004-1: Surface Mount Schottky Barrier Diode, 100 V, -55 to 125 degC, 2-Pin SOD123, RoHS, Tape and Reel; Manufacturer: Diodes Inc; IR@1.5 V: 0.3 uA Max.; VF@10 mA: 0.45 V Max.; CT@1 V: 12 pF Typ.; PartNumber: BAT46W-7-F; ComponentLink1URL: http://www.diodes.com/; ComponentLink3URL: http://diodes.com/datasheets/ds30044.pdf; PackageDescription: 2-Pin SMD, Body 2.7 x 1.55 mm, Height 1.45 mm; ComponentLink2Description: Datasheet; ComponentLink3Description: Package Specification; Mounting Technology: Surface Mount; ComponentLink1Description: Manufacturer URL; RoHS: TRUE; Operating Temperature: -55 to 125 degC; Packing: Tape and Reel; ComponentLink2URL: http://diodes.com/datasheets/ds30044.pdf; DatasheetVersion: Rev. 16-2
DS1 DS2 = CMP-2000-07254-1: Low Current LED, 40 mW, 1.8 V, -40 to 100 degC, 2-Pin SMD (0603), RoHS, Tape and Reel; Manufacturer: Vishay; Lens Shape: Rectangular; Automotive Qualification Standard: AEC-Q100; Wavelength Typ: 636nm; SVHC: ToBeAdvised; LED Colour: Red; Bulb Size: 1.6mmx0.8mm; Forward Voltage: 1.8V; Luminous Intensity: 4mcd; Forward Current If: 2mA; Viewing Angle: 80°; Datasheet Version: Rev. 1.7, 02/2011; Datasheet URL: https://datasheet.ciiva.com/5798/1698881-5798337.pdf; LED Mounting: SMD; Packaging: CutTape; Package Reference: TLMS1000; Manufacturer URL: http://www.vishay.com/; Mounting Technology: SurfaceMount; Product Range: -; Package Description: 2-Pin Surface Mount Device, Body 1.6 x 0.8 mm; MSL: MSL2-1year
J1 = CMP-1502-01307-1: SMT Vertical Socket Header WR-PHD, Pitch 2.54 mm, Dual Row, 14 pins; Manufacturer: Wurth Elektronik; Rated Current: 3A; Pin Number: 14; Withstanding Voltage: 600VAC; Pitch: 2.54mm; Contact Resistance: 20mOhm; Gender: Female; Working Voltage: 250VAC; Orientation: Vertical; Publisher: WurthElektronik; Row Number: Dual; Datasheet URL: https://katalog.we-online.de/em/datasheet/6103xx21821.pdf; Mounting Technology: SMT; Manufacturer URL: http://www.we-online.de; Operating Temperature: -40to105degC; Package Reference: 61031421821; Packaging: TapeandReel; Part Number: 61031421821
L2 L5 = CMP-0227-00402-1: SMD Shielded Tiny Power Inductor WE-TPC, L = 47.0 µH; ComponentLink2URL: http://www.we-online.de/katalog/media/pdf/744052470.pdf; PackageReference: WE-TPC-5818-L; PackageVersion: 2010; ComponentLink2Description: Datasheet; DatasheetVersion: ver 7, Aug-2010; PackageDescription: SMD Inductor, 2-Leads, Body 5.8 x 5.8 mm; ComponentLink1Description: Manufacturer Link; ComponentLink1URL: http://www.we-online.com
L3 L4 = CMP-0227-00334-1: SMD Shielded Tiny Power Inductor WE-TPC, L = 100 µH; PackageDescription: SMD Inductor, 2-Leads, Body 4.8 x 4.8 mm; PackageVersion: 2010; ComponentLink1URL: http://www.we-online.com; ComponentLink2URL: http://www.we-online.de/katalog/media/pdf/744043101.pdf; ComponentLink1Description: Manufacturer Link; PackageReference: WE-TPC-4828-MH; ComponentLink2Description: Datasheet; DatasheetVersion: ver 6, Aug-2010
R1 = CMP-2001-04765-1: 33.2K; Manufacturer: Vishay Dale; Part Number: TNPW080533K2BEEN
R2 R4 = CMP-2001-04733-1: Manufacturer: Vishay Dale; Part Number: TNPW0805150KBEEN
R3 = CMP-2001-04765-1: 33.2K; Part Number: TNPW080533K2BEEN; Manufacturer: Vishay Dale
R5 R7 R36 R38 R39 R41-R43 = CMP-2003-04857-1: Part Number: CRCW12060000Z0EA; Manufacturer: Vishay Dale
R6 R8 R10 R12 R13 R15 R17 R18 R20 R35 = Res Semi: Semiconductor Resistor; Published: 8-Jun-2000; LatestRevisionDate: 17-Jul-2002; LatestRevisionNote: Re-released for DXP Platform.; PackageReference: AXIAL-0.5; Publisher: Altium Limited; PackageDescription: Axial Device, Thru-Hole; 2 Leads; 0.5 in Pin Spacing
R9 R16 R37 R40 = CMP-2001-04720-1: Manufacturer: Vishay Dale; Part Number: TNPW0805100KBEEA
R14 R21 R23 R26 R28 R31 R32 = CMP-2100-03662-1: Chip Resistor, 100 KOhm, +/- 1%, 0.1 W, -55 to 155 degC, 0603 (1608 Metric), RoHS, Tape and Reel; Manufacturer: Yageo; Power Rating: 100mW; Voltage Rating: 50V; Temperature Coefficient: 100ppm/degreesC; Datasheet Version: Rev. 5, 10/2016; Height: 0.45mm; Lead Free: LeadFree; Manufacturer URL: http://www.yageo.com/; Package Reference: 0603; Depth: 0.8mm; RoHSCompliant: true; Composition: ThickFilm; Military Standard: Not; Case/Package: 0603; Packaging: TapeandReel; Case Code (Imperial): 0603; Voltage Rating (DC): 50V; Case Code (Metric): 1608; Tolerance: 1%; Termination: SMD/SMT; Min Operating Temperature: -55degC; Number of Pins: 2; Length: 1.6mm; Width: 0.8mm; Datasheet URL: http://www.yageo.com/NewPortal/yageodocoutput?fileName=/pdf/R-Chip/PYu-RC_Group_51_RoHS_L_5.pdf; Package Description: 2-Pin Surface Mount Device, Body 1.6 x 0.8 mm; Max Operating Temperature: 155degC; REACH SVHC: NoSVHC
R19 R22 R25 R27 R30 R33 = CMP-2000-00180-1: Manufacturer: Panasonic; Part Number: ERJ-3EKF1001V
R24 R29 = CMP-2001-03595-1: CRCW08051K00FKEA; Manufacturer: Vishay Dale; Part Number: CRCW08051K00FKEA
R34 = CMP-2000-04517-1: Manufacturer: Yageo; Part Number: RT0603BRE0710KL
RN1 RN2 = CMP-09039-000001-1: RES ARRAY 4 RES 1K OHM 8TSSOP; Manufacturer: Analog Devices; Standoff Height: 0.0508mm; Power Per Resistor: 800mW; Number Of Resistors: 4; Resistance: 1kΩ; Voltage Rating: 75V; Tolerance: 7.5%; Value: 1kΩ; Temperature Coefficient: 8ppm/°C; Height: 1.1mm; Octopart: https://octopart.com/lt5400ahms8e-4%23pbf-analog+devices-88940367; Package: MS8E-8-05-08-1662; ComponentLink2URL: https://www.analog.com/media/en/technical-documentation/data-sheets/5400fc.pdf; Automotive: No; Temperature Range Low: -40°C; Digikey Description: RES ARRAY 4 RES 1K OHM 8TSSOP; Lead Free: Yes; Ipc Land Pattern Name: SOP65P490X110-8; Device Class L1: Passive Components; Category: Res; ComponentLink2Description: Datasheet; RoHS: TRUE; Device Class L2: Resistors; Device Class L3: Resistor Arrays; Termination: Gull-Wing; Series: LT5400; Manufacturer Part Number: LT5400AHMS8E-4#PBF; Temperature Range High: +125°C; Temperature: -40°C to +125°C
SW1 = CMP-2000-05100-1: PCB Switch, SPDT, 12 V, 500 mA, 6 W, -40 to 85 degC, 3-Pin THD, RoHS, Tape and Reel; Manufacturer: EOZ; Number of Positions: 2; Contact Current Rating: 500mA@24V; Mechanical Life: 10000Operations; Actuator Type: Slide; Package Style: SIP; Manufacturer URL: http://eozonline.com/; Mounting Type: ThroughHole; Operating Temperature Range: -40→+85degC; Datasheet Version: Apr-10; Datasheet URL: http://www.farnell.com/datasheets/1683364.pdf; Maximum Operating Temperature: +85degC; Minimum Operating Temperature: -40degC; Contact Material: GoldoverNickelPlated
TP1-TP10 TP12 TP13 = CMP-2000-05182-1: Test Point, White, 1-Pin THD, RoHS, Bulk; Manufacturer: KeystoneElectronics; Outside Diameter: 2.54mm; Plating: Silver; Mounting Hole Size: 1mm; Product: TestPoints; Packaging: Bulk; Manufacturer URL: http://www.keyelco.com/; Length: 7.62mm; Datasheet Version: Rev. G, 12/2008; Type: Miniature; Product Category: CircuitBoardHardware-PCB; Material: Nylon; RoHS: True; Contact Material: PhosphorBronze; Datasheet URL: https://ciiva.com/datasheet-click-2917627?src=ciiva&sig=bd195616; Color: White; Brand: KeystoneElectronics
TP11 TP14-TP16 = CMP-2000-05181-1: Test Point, Black, 1-Pin THD, RoHS, Bulk; Manufacturer: Keystone; Other Names: 5001K; Catalog Drawings: 5000Series; Alternate Color: 5004K-ND / -TESTPOINTPCMINI.040"DYELLOW / 5003K-ND / -TESTPOINTPCMINI.040"DORANGE / 5002K-ND / -TESTPOINTPCMINI.040"DWHITE / 5000K-ND / -TESTPOINTPCMINI.040"DRED; Kits: DKTGRS232C-KIT-ND / -TTLCONVERTER; Online Catalog: ColorCodedTestPoints; Datasheet URL: https://ciiva.com/datasheet-click-2917627?src=ciiva&sig=bd195616; Mounting Type: 0.040"(1.02mm)HoleDiameter; Family: TestPoints; RoHS Information: RoHSComplianceStatement; Datasheet Version: Rev. G, 12/2008; Color: Black; Category: TestandMeasurement; Standard Package: 100; Manufacturer URL: http://www.keyelco.com/; Material: Base,Nylon46,UL94V-0; Type: PCTestPoint,Miniature; Terminal: 0.010"x0.020"(0.25mmx0.51mm)PhosphorBronzeWire,SilverPlated; Series: THM; Packaging: Bulk
U3 = CMP-0784-00254-1: Ultralow Noise, High Accuracy Voltage Reference, 2.5 V Output, 3 to 15 V Supply, Industrial, 8-pin SOIC (R-8), Tube; Manufacturer: Analog Devices; Min V Supply (V): 3; Max V Supply (V): 15; Ref Out TC (ppm/C): 2; Code_JEDEC: MS-012-AA; ComponentLink2URL: http://www.analog.com/static/imported-files/data_sheets/ADR4520_4525_4530_4533_4540_4550.pdf; ComponentLink4Description: URL Link1; ComponentLink3Description: Package Specification; Packing: Tube; ComponentLink4URL: Product URL:http://www.analog.com/en/special-linear-functions/voltage-references/adr4525/products/product.html; PackageVersion: 060506-A, 06/2006; Operating Temp Range: -40 to 125 degC; PartNumber: ADR4525BRZ; DatasheetVersion: Rev. 0; PackageReference: R-8; ComponentLink1Description: Manufacturer URL; ComponentLink2Description: Datasheet; PackageDescription: 8-Pin Standard Small Outline Package, Body 4.9 x 3.9 mm, Pitch 1.27 mm; ComponentLink1URL: http://www.analog.com/en/index.html; ComponentLink3URL: http://www.analog.com/static/imported-files/packages/PKG_PDF/SOIC_Narrow%20(R)/R_8.pdf; Mounting Technology: Surface Mount
U4 = MAX11254ATJ+: Integrated Circuit; Manufacturer_Name: Maxim Integrated; Datasheet Link: https://componentsearchengine.com/Datasheets/1/MAX11254ATJ+.pdf; Height: 0.8mm; Manufacturer_Part_Number: MAX11254ATJ+; Mouser Part Number: 700-MAX11254ATJ+; Mouser Price/Stock: https://www.mouser.com/Search/Refine.aspx?Keyword=700-MAX11254ATJ%2B; RS Part Number: 1904590; RS Price/Stock: http://uk.rs-online.com/web/p/products/1904590
U7 = CMP-0384-01713-2: Single Channel RRIO Operational Amplifier, 6.5 MHz BW, 500 mV/us SR, Industrial, 8-pin SOP (RM-8), Tube; Manufacturer: Analog Devices; V Span Min: 2.2V; Amplifiers Per Package: 1; Input Offset Voltage: 300nV; Input Bias Current: 90pA; V Span Max: 5.5V; Iq/Amp: 1.4mA; Small Signal Bandwidth: 6.5MHz; Mounting Technology: Surface Mount; ComponentLink2Description: Datasheet; ComponentLink2URL: http://www.analog.com/static/imported-files/data_sheets/ADA4528-1_4528-2.pdf; ComponentLink3URL: http://www.analog.com/static/imported-files/packages/PKG_PDF/MSOP%28RM%29/RM_8.pdf; PackageDescription: 8-Pin Mini Small Outline Package, Body 3 x 3 mm, Pitch 0.65 mm; ComponentLink3Description: Package Specification; Slew Rate: 500mV/us; Code_JEDEC: MO-187-AA; Packing: Tube; RevisionNote: Reference Circuit URL fixed; ComponentLink1URL: http://www.analog.com/en/index.html; ComponentLink4URL: http://search.analog.com/search/ProductSearch.aspx?query=ada4528-1&amp;locale=en#product-recommendations; ComponentLink1Description: Manufacturer URL; ComponentLink4Description: Reference Circuit; PackageReference: RM-8; DatasheetVersion: Rev. C; Generic Part Number: ADA4528-1; PartNumber: ADA4528-1ARMZ
U8 = CMP-0859-00826-3: 1-of-2 Decoder/Demultiplexer, DRL0006A, LARGE T&R; Manufacturer: Texas Instruments; Output Type: CMOS; Technology Family: LVC; F @ Nom Voltage(Max)(Mhz): 150; ICC @ Nom Voltage(Max)(mA): 0.01; Schmitt Trigger: No; Sub-Family: Decoder/Encoder/Multiplexer; Logic: True; Output Drive (IOL/IOH)(Max)(mA): 32/-32; Input Type: CMOS/TTL; VCC(Max)(V): 5.5; Rating: Catalog; Voltage(Nom)(V): 1.8,2.5,3.3,5; VCC(Min)(V): 1.65; tpd @ Nom Voltage(Max)(ns): 16.1,6.5,5.2,3.9; Bits(#): 1; 3-State Output: No; Operating Temperature Range(C): -40 to 85; Generic Part Number: SN74LVC1G19; DatasheetVersion: SCES464F; PackageReference: DRL0006A; Specialty Logic Family: Decoder/Encoder/Multiplexer
U9 = ADP1031ACPZ: No Description Available; Copyright: Copyright (C) 2018 Accelerated Designs. All rights reserved; RefDes: RefDes; Type: DEV; Value: Value
U10 = CMP-04895-000017-1: IC OPAMP PGA 1 CIRCUIT 16TSSOP; Manufacturer: Texas Instruments; Standoff Height: 0.05mm; Max Supply Voltage: 36V; Min Dual Supply Voltage: 15.5V; Max Dual Supply Voltage: 18V; Input Offset Voltage: 0.12mV; Input Bias Current: 0.0008uA; Max Junction Temp: +150°C; Gain Bandwidth: 6MHz; Min Supply Voltage: 10V; Number Of Channels: 1; Temperature Range High: +125°C; Temperature: -40°C to +125°C; Octopart: https://octopart.com/pga281aipwr-texas+instruments-28037191; ComponentLink2URL: http://www.ti.com/lit/ds/symlink/pga281.pdf; Package: PW0016A; ComponentLink2Description: Datasheet; Category: IC; Automotive: No; Manufacturer Part Number: PGA281AIPWR; Mouser Description: Instrumentation Amplifiers Zero-Drift,High Vltg Program Gain Amp; Lead Free: Yes; Temperature Range Low: -40°C; Height: 1.2mm; Device Class L3: Instrumentation; Device Class L1: Integrated Circuits (ICs); RoHS: TRUE; Digikey Description: IC OPAMP PGA 1 CIRCUIT 16TSSOP; Device Class L2: Linear ICs
U11 = AD5753BCPZ: No Description Available; Copyright: Copyright (C) 2018 Accelerated Designs. All rights reserved; RefDes: RefDes; Type: Type; Value: Value
U12 = CMP-09116-000003-2: IC OPAMP ZERO-DRIFT 2 CIRC 8MSOP; Max Dual Supply Voltage: 27.5V; Power Supply Rejection Ratio (PSRR): 150dB; Operating Supply Current: 830uA; Max Supply Voltage: 55V; Min Dual Supply Voltage: 2.25V; Input Bias Current: 50pA; Gain Bandwidth Product: 2.7MHz; Voltage Gain: 137dB; Common Mode Rejection Ratio: 140dB; Slew Rate: 1.7V/µs; Input Offset Voltage (Vos): 1.5uV; Output Current per Channel: 32mA; Min Supply Voltage: 4.5V; Packaging: Rail/Tube; Max Operating Temperature: 125°C; Min Operating Temperature: -40°C; Mount: Surface Mount; Number of Pins: 8; Case/Package: MSOP; Lead Free: Contains Lead